# Altium schematic sheet FoxTx.SchDoc
size A4
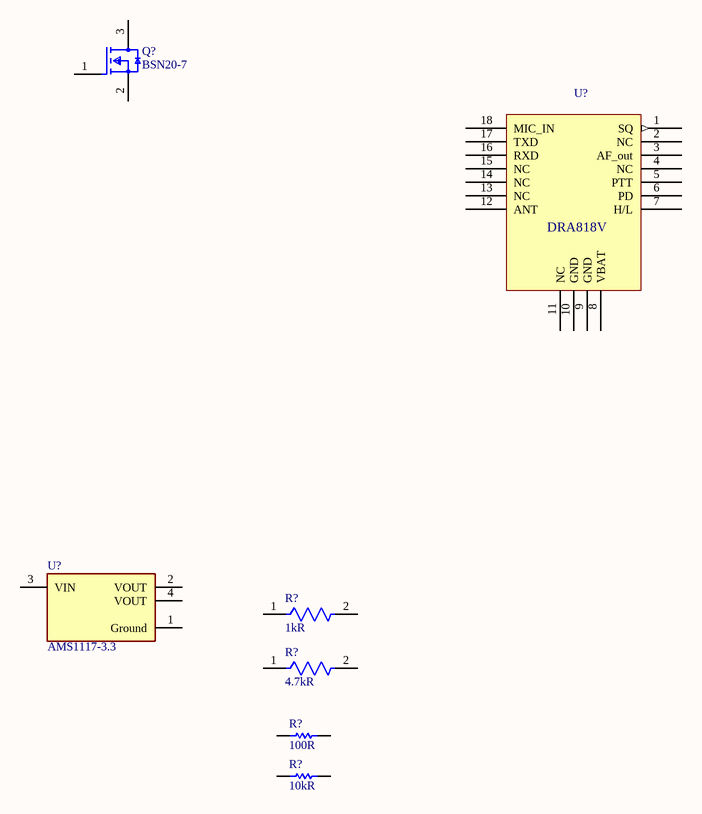
[diagram p0: FoxTx.SchDoc]

## Parts
(Parts that share a designator on the sheet are numbered #1, #2 ... from top to bottom, then left to right.)
Q?  BSN20-7  [FP-SOT23-IPC_C]
R?#1  1kR  [FP-CRCW0603-e3-IPC_A]
R?#2  4.7kR  [FP-CRCW0603-e3-IPC_A]
R?#3  100R  [RESC1609X50X30ML8T20]
R?#4  10kR  [RESC1609X50X30NL8T20]
U?#1  DRA818V  [DRA818_breakout]  (value not drawn)
U?#2  AMS1117-3.3  [FP-AMS1117-IPC_C]

## Nets

Not connected (* = marked no-connect by the designer): Q? 1(G) 2(S) 3(D); R?#1 1 2; R?#2 1 2; R?#3 1 2; R?#4 1 2; U?#1 1(SQ) 2(NC) 3(AF_out) 4(NC) 5(PTT) 6(PD) 7(H/L) 8(VBAT) 9(GND) 10(GND) 11(NC) 12(ANT) 13(NC) 14(NC) 15(NC) 16(RXD) 17(TXD) 18(MIC_IN); U?#2 1(Ground) 2(VOUT) 3(VIN) 4(VOUT)

## Library data of the parts
Q? = CMP-12801-000044-2: MOSFET N-CH 50V 500MA SOT23; Turn-On Delay Time: 2.93ns; Max Power Dissipation: 600mW; Drain to Source Resistance: 1.8R; Rise Time: 2.99ns; Turn-Off Delay Time: 9.45ns; Number of Elements: 1; Fall Time: 8.3ns; Gate to Source Voltage (Vgs): 20V; Element Configuration: Single; Input Capacitance: 40pF; Min Operating Temperature: -55°C; Lead Free: Lead Free; Contact Plating: Tin; Number of Pins: 3; Case/Package: SOT-23; Radiation Hardening: No; Drain to Source Voltage (Vdss): 50V; Continuous Drain Current (ID): 500mA; Max Operating Temperature: 150°C; Weight: 0.000282oz; Width: 1.4mm; Length: 3mm; Rds On Max: 1.8R; Height: 1mm; Mount: Surface Mount; Power Dissipation: 600mW; Package Quantity: 3000; Packaging: Tape and Reel; Number of Channels: 1; REACH SVHC: No SVHC
R?#1 = CMP-1012-00074-3: RES Thick Film, 1kΩ, 5%, 0.1W, 200ppm/°C, 0603; Power Rating: 100mW; Voltage Rating: 75V; Max Operating Temperature: 155°C; Number of Pins: 2; Min Operating Temperature: -55°C; Length: 1.55mm; Number of Terminations: 2; Composition: Thick Film; Packaging: Tape and Reel; Max Power Dissipation: 100mW; Temperature Coefficient: 200ppm/°C; Case/Package: 0603; Case Code (Imperial): 0603; Depth: 0.85mm; Tolerance: 5%; Package Quantity: 10000; Lead Free: Lead Free; Features: Automotive AEC-Q200; Height: 0.02inch; Case Code (Metric): 1608; Weight: 7.1E-05oz; Radiation Hardening: No; Width: 0.85mm; Resistance: 1kR; Voltage Rating (DC): 75V; Contact Plating: Tin; Termination: SMD/SMT; Military Standard: Not
R?#2 = CMP-1666-00019-3: RES Thick Film, 4.7kΩ, 1%, 0.1W, 100ppm/°C, 0603; Voltage Rating: 75V; Power Rating: 100mW; Case Code (Metric): 1608; Military Standard: Not; Packaging: Tape and Reel; Termination: SMD/SMT; Resistance: 4.7kR; Temperature Coefficient: 100ppm/°C; Lead Free: Lead Free; Length: 1.55mm; Width: 0.85mm; Height: 0.45mm; Depth: 0.85mm; Weight: 7.1E-05oz; Case Code (Imperial): 0603; Contact Plating: Tin; Case/Package: 0603; Max Operating Temperature: 155°C; Mount: Surface Mount; Tolerance: 1%; Min Operating Temperature: -55°C; Package Quantity: 5000; Voltage Rating (DC): 75V; Composition: Thick Film
R?#3 = CMP-2000-03824-5: Chip Resistor, 100 Ohm, +/- 1%, 100 mW,-55 to 155 degC, 0603 (1608 Metric), RoHS, Tape and Ree; Manufacturer: Vishay Semiconductor; Manufacturer Part Number: CRCW0603100RFKEA; Description: Res Thick Film 0603 100 Ohm 1% 1/10W ±100ppm/°C Molded SMD Paper T/R; Power Rating: 100mW; Temperature Coefficient: 100ppm/°C; Voltage Rating (DC): 75V; ComponentLink2URL: http://www.vishay.com/docs/20035/dcrcwe3.pdf; ComponentLink1URL: http://www.vishay.com/; Mounting Technology: Surface Mount; ComponentLink1Description: Manufacturer URL; ComponentLink2Description: Datasheet; PackageDescription: 2-Pin Surface Mount Device, Body 1.575 x 0.85 mm; PackageReference: 0603; DatasheetVersion: 06/2012; Supplier 1: Digi-Key; Supplier Part Number 1: 541-100HCT-ND; RoHS: Yes; Category: Chip SMD Resistors; Stock 1: 340768; Pricing 1: 1=0.10000, 10=0.03800, 100=0.01560, 1000=0.00701, 2500=0.00608 (USD); Mount: Surface Mount; Case/Package: 0603; Number of Pins: 2; Weight: 7.1E-05oz; Case Code (Metric): 1608; Case Code (Imperial): 0603; Contact Plating: Tin; Size Code: 0603; Min Operating Temperature: -55°C; Max Operating Temperature: 155°C; Resistance: 100R; Tolerance: 1%; Packaging: Tape and Reel; Resistor Type: Thick Film; Package Quantity: 10; Voltage Rating: 75V; Number of Terminations: 2; Termination: SMD/SMT; Max Power Dissipation: 100mW; Features: Automotive AEC-Q200; Series: CRCW; Construction: Rectangular; Resistance Tolerance: 1%; Length: 1.55mm; Width: 0.033inch; Height: 0.02inch; Depth: 0.85mm; Ratings: AEC-Q200; Radiation Hardening: No; Lead Free: Lead Free; RoHS Compliant: Yes; Military Standard: Not
R?#4 = CMP-1666-00005-4: Chip Resistor, 10 KOhm, +/- 1%, 100 mW, -55 to 155 degC, 0603 (1608 Metric), RoHS, Tape and Reel; Manufacturer: Vishay Semiconductor; Manufacturer Part Number: CRCW060310K0FKEA; Voltage Rating: 75 V; Description: Res Thick Film 0603 10K Ohm 1% 1/10W ±100ppm/°C Molded SMD Paper T/R; Power Rating: 100mW; Temperature Coefficient: 100ppm/°C; Voltage Rating (DC): 75V; Max Operating Temperature: 155 degC; PackageDescription: 2-Pin Surface Mount Device, Body 1.575 x 0.85 mm; ComponentLink1Description: Manufacturer URL; RoHSCompliant: true; PackageReference: 0603; REACH SVHC: Unknown; Length: 1.55 mm; DatasheetVersion: 06/2012; Packaging: Tape and Reel; Min Operating Temperature: -55 degC; Mounting Technology: Surface Mount; ComponentLink2URL: https://datasheet.ciiva.com/11809/0900766b80d98afc-11809037.pdf; Height: 0.45 mm; ComponentLink2Description: Datasheet; Package Quantity: 5000; ComponentLink1URL: http://www.vishay.com/; Supplier 1: Digi-Key; Supplier Part Number 1: 541-10.0KHCT-ND; RoHS: Yes; Category: Chip SMD Resistors; Stock 1: 78374; Pricing 1: 1=0.10000, 10=0.03800, 100=0.01560, 1000=0.00701, 2500=0.00608 (USD); Case/Package: 0603; Number of Pins: 2; Contact Plating: Tin; Weight: 7.1E-05oz; Case Code (Metric): 1608; Case Code (Imperial): 0603; Size Code: 0603; Resistance: 10kR; Tolerance: 1%; Resistor Type: Thick Film; Number of Terminations: 2; Termination: SMD/SMT; Max Power Dissipation: 100mW; Features: Automotive AEC-Q200; Series: CRCW; Construction: Rectangular; Resistance Tolerance: 1%; Technology: THICK FILM; Width: 0.033inch; Depth: 0.85mm; Radiation Hardening: No; Lead Free: Lead Free; RoHS Compliant: Yes; Military Standard: Not; ComponentLink3URL: https://datasheet.ciiva.com/11809/0900766b80d98afc-11809037.pdf?src-supplier=RSComponents; ComponentLink3Description: https://datasheet.ciiva.com/11809/0900766b80d98afc-11809037.pdf?src-supplier=RSComponents; ComponentLink4URL: https://datasheet.ciiva.com/26314/fld-crcw-e3-data-en-26314749.pdf?src-supplier=Distrelec; ComponentLink4Description: https://datasheet.ciiva.com/26314/fld-crcw-e3-data-en-26314749.pdf?src-supplier=Distrelec; ComponentLink5URL: https://datasheet.ciiva.com/46385/1697337-46385498.pdf?src-supplier=Element14; ComponentLink5Description: https://datasheet.ciiva.com/46385/1697337-46385498.pdf?src-supplier=Element14; ComponentLink6URL: https://datasheet.ciiva.com/2465/dcrcwe3-2465514.pdf?src-supplier=Digi-Key; ComponentLink6Description: https://datasheet.ciiva.com/2465/dcrcwe3-2465514.pdf?src-supplier=Digi-Key; ComponentLink7URL: https://datasheet.ciiva.com/2465/dcrcwe3-2465515.pdf?src-supplier=Digi-Key; ComponentLink7Description: https://datasheet.ciiva.com/2465/dcrcwe3-2465515.pdf?src-supplier=Digi-Key; ComponentLink8URL: https://datasheet.ciiva.com/2465/dcrcwe3-2465513.pdf?src-supplier=Digi-Key; ComponentLink8Description: https://datasheet.ciiva.com/2465/dcrcwe3-2465513.pdf?src-supplier=Digi-Key; ComponentLink9URL: https://datasheet.ciiva.com/16719/70201119-16719704.pdf?src-supplier=Allied+Electronics; ComponentLink9Description: https://datasheet.ciiva.com/16719/70201119-16719704.pdf?src-supplier=Allied+Electronics; ComponentLink10URL: https://datasheet.ciiva.com/16754/70201119-16754710.pdf?src-supplier=Allied+Electronics; ComponentLink10Description: https://datasheet.ciiva.com/16754/70201119-16754710.pdf?src-supplier=Allied+Electronics; ComponentLink11URL: https://datasheet.ciiva.com/5543/dcrcwe3-109170-5543001.pdf?src-supplier=Mouser; ComponentLink11Description: https://datasheet.ciiva.com/5543/dcrcwe3-109170-5543001.pdf?src-supplier=Mouser; ComponentLink12URL: https://datasheet.ciiva.com/3256/dcrcwe3-3256940.pdf?src-supplier=Avnet; ComponentLink12Description: https://datasheet.ciiva.com/3256/dcrcwe3-3256940.pdf?src-supplier=Avnet; ComponentLink13URL: https://datasheet.ciiva.com/16209/dcrcwe3-16209164.pdf?src-supplier=Future+Electronics; ComponentLink13Description: https://datasheet.ciiva.com/16209/dcrcwe3-16209164.pdf?src-supplier=Future+Electronics; ComponentLink14URL: https://datasheet.ciiva.com/26821/getdatasheetpartid-86831-26821109.pdf?src-supplier=Verical; ComponentLink14Description: https://datasheet.ciiva.com/26821/getdatasheetpartid-86831-26821109.pdf?src-supplier=Verical; ComponentLink15URL: https://datasheet.ciiva.com/3256/dcrcwe3-3256939.pdf?src-supplier=Avnet; ComponentLink15Description: https://datasheet.ciiva.com/3256/dcrcwe3-3256939.pdf?src-supplier=Avnet
U?#2 = CMP-209535-000001-1: LDO Voltage Regulators 1A, 3.3V; Manufacturer: Advanced Monolithic Systems; Dropout Voltage: 1.1V; Output Type: Fixed; Nominal Supply Current: 5mA; Max Power Dissipation: 1.2W; Max Supply Voltage: 15V; Number Of Outputs: 1; Standoff Height: 0.64mm; Max Junction Temp: +125°C; Height: 1.8mm; Package: AMS1117; Device Class L2: Power Management ICs; ComponentLink2Description: Datasheet; ComponentLink2URL: http://www.advanced-monolithic.com/pdf/ds1117.pdf; Category: IC; RoHS: TRUE; Automotive: No; Device Class L1: Integrated Circuits (ICs); Output Current: 1A; Device Class L3: Voltage Regulators - Linear; Temperature: -40°C to +125°C; Output Voltage: 3.3V; Manufacturer Part Number: AMS1117-3.3; Temperature Range Low: -40°C; Octopart: https://octopart.com/ams1117-3.3-advanced+monolithic+systems-25899300; Lead Free: Yes; Ipc Land Pattern Name: SOT229P700X180-4; Temperature Range High: +125°C